# EAGLE design pblcompleted (EAGLE 9.6.2)
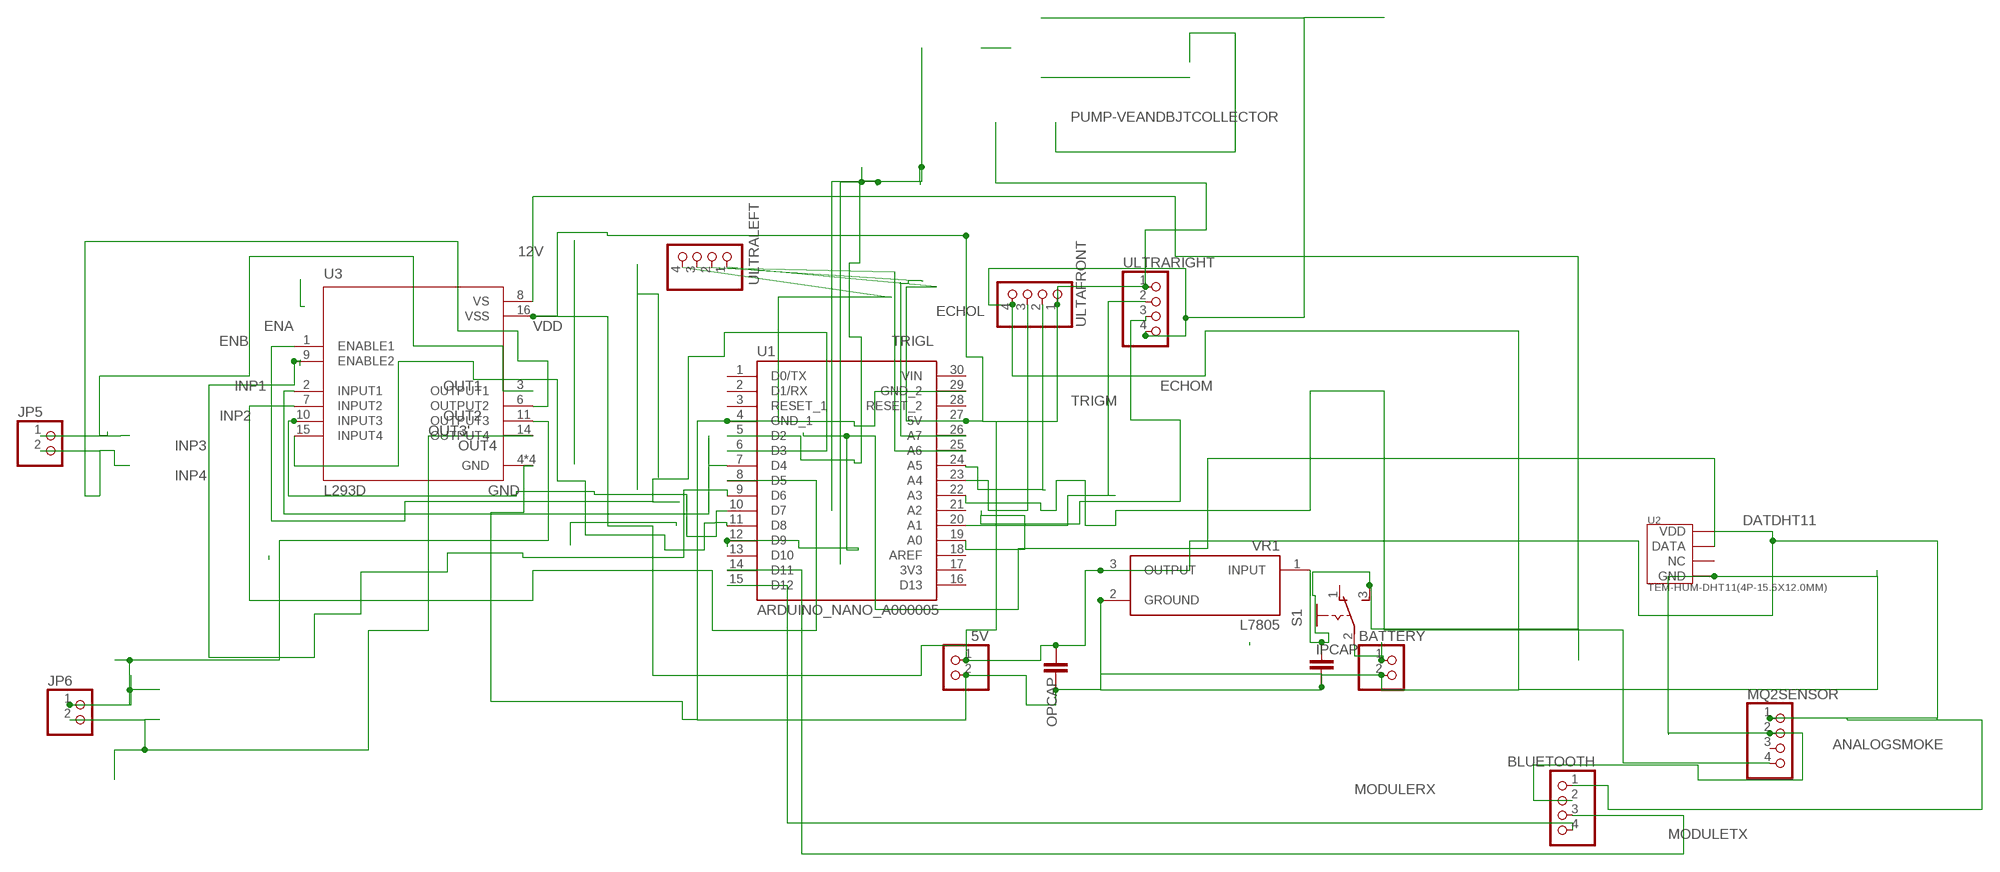
[diagram p0: schematic, sheet 1]

## Parts
5V  PINHD-1X2  [1X02]
BATTERY  PINHD-1X2  [1X02]
BLUETOOTH  PINHD-1X4  [1X04]
IPCAP  C2,5-3  [C2.5-3]
JP5  PINHD-1X2  [1X02]
JP6  PINHD-1X2  [1X02]
MQ2SENSOR  PINHD-1X4  [1X04]
OPCAP  C2,5-3  [C2.5-3]
S1  255SB  [255SB]
U1  ARDUINO_NANO_A000005  [MODULE_ARDUINO_NANO_A000005]
U2  TEM-HUM-DHT11(4P-15.5X12.0MM)  [SNR4-2.54-15.5X12.0X5.5MM]
U3  L293D  [DIP880W50P254L2000H510Q16]
ULTAFRONT  PINHD-1X4  [1X04]
ULTRALEFT  PINHD-1X4  [1X04]
ULTRARIGHT  PINHD-1X4  [1X04]
VR1  L7805  [TO255P1020X450X2000-3]

## Nets
12V: IPCAP.1 S1.3(S) U3.8(VS) VR1.1(INPUT)
ANALOGSMOKE: MQ2SENSOR.4 U1.22(A3)
DATDHT11: U1.12(D9) U2.2(DATA)
ECHOL: U1.25(A6) ULTRALEFT.3
ECHOM: U1.23(A4) ULTAFRONT.3
ECHOR: U1.19(A0) ULTRARIGHT.3
ENA: U1.6(D3) U3.1(ENABLE1)
ENB: U1.9(D6) U3.9(ENABLE2)
GND: 5V.2 BATTERY.2 BLUETOOTH.2 IPCAP.2 MQ2SENSOR.2 OPCAP.1 U1.4(GND_1) U1.29(GND_2) U2.4(GND) U3.4(GND) U3.5(GND) U3.12(GND) U3.13(GND) ULTAFRONT.4 ULTRALEFT.4 ULTRARIGHT.4 VR1.2(GROUND)
INP1: U1.7(D4) U3.2(INPUT1)
INP2: U1.8(D5) U3.7(INPUT2)
INP3: U1.10(D7) U3.10(INPUT3)
INP4: U1.11(D8) U3.15(INPUT4)
MODULERX: BLUETOOTH.4 U1.15(D12)
MODULETX: BLUETOOTH.3 U1.14(D11)
N$6: BATTERY.1 S1.2(P)
N$14: U1.5(D2)
OUT1: JP5.1 U3.3(OUTPUT1)
OUT2: JP5.2 U3.6(OUTPUT2)
OUT3': JP6.1 U3.11(OUTPUT3)
OUT4: JP6.2 U3.14(OUTPUT4)
TRIGL: U1.26(A7) ULTRALEFT.2
TRIGM: U1.24(A5) ULTAFRONT.2
TRIGR: U1.20(A1) ULTRARIGHT.2
VDD: 5V.1 BLUETOOTH.1 MQ2SENSOR.1 OPCAP.2 U1.27(5V) U2.1(VDD) U3.16(VSS) ULTAFRONT.1 ULTRALEFT.1 ULTRARIGHT.1 VR1.3(OUTPUT)
Unconnected: MQ2SENSOR.3 S1.1(O) U1.1(D0/TX) U1.2(D1/RX) U1.3(RESET_1) U1.13(D10) U1.16(D13) U1.18(AREF) U1.21(A2) U1.28(RESET_2) U2.3(NC)

## Power pins joined to a net without a drawn wire
3V3: U1.17(3V3)
VIN: U1.30(VIN)

## Library data of the parts
5V BATTERY JP5 JP6 = pinhead:PINHD-1X2: PIN HEADER
BLUETOOTH MQ2SENSOR ULTAFRONT ULTRALEFT ULTRARIGHT = pinhead:PINHD-1X4: PIN HEADER
IPCAP OPCAP = capacitor-wima:C: CAPACITOR naming: grid - package width
S1 = switch:255SB: SLIDING SWITCH Distributor Buerklin, 11G810
U1 = ARDUINO_NANO_A000005:ARDUINO_NANO_A000005: Check availability <https://pricing.snapeda.com/parts/ARDUINO%20NANO%20A000005/Arduino/view-part?ref=eda>; AVAILABILITY: Not in stock; CHECK_PRICES: https://www.snapeda.com/parts/ARDUINO%20NANO%20A000005/Arduino/view-part/?ref=eda; DESCRIPTION: ATSAMD21G18A Arduino Nano 33 IoT series ARM® Cortex®-M0+ MCU 32-Bit Embedded Evaluation Board; MF: Arduino; MP: ARDUINO NANO A000005; PACKAGE: Non-Standard Arduino; PRICE: None; SNAPEDA_LINK: https://www.snapeda.com/parts/ARDUINO%20NANO%20A000005/Arduino/view-part/?ref=snap
U2 = TEM-HUM-DHT11_4P-15.5X12.0MM_:TEM-HUM-DHT11(4P-15.5X12.0MM): Check availability <https://pricing.snapeda.com/parts/DHT11/aosong/view-part?ref=eda>; AVAILABILITY: In Stock; CHECK_PRICES: https://www.snapeda.com/parts/DHT11/Aosong+Electronics/view-part/?ref=eda; DESCRIPTION: Temperature Humidity Sensor 16bi; MF: aosong; MP: DHT11; PACKAGE: None; PRICE: None; SNAPEDA_LINK: https://www.snapeda.com/parts/DHT11/Aosong+Electronics/view-part/?ref=snap
U3 = L293D:L293D: Check availability <https://pricing.snapeda.com/parts/L293D/STMicroelectronics/view-part?ref=eda>; AVAILABILITY: In Stock; CHECK_PRICES: https://www.snapeda.com/parts/L293D/STMicroelectronics/view-part/?ref=eda; DESCRIPTION: Bipolar Motor Driver - Parallel 16-PowerDIP; MF: STMicroelectronics; MP: L293D; PACKAGE: DIP-16 STMicroelectronics; PRICE: None; SNAPEDA_LINK: https://www.snapeda.com/parts/L293D/STMicroelectronics/view-part/?ref=snap
VR1 = L7805:L7805: Check availability <https://pricing.snapeda.com/parts/L7805/STMicroelectronics/view-part?ref=eda>; AVAILABILITY: In Stock; CHECK_PRICES: https://www.snapeda.com/parts/L7805/STMicroelectronics/view-part/?ref=eda; DESCRIPTION: Standard Regulator Pos 5V 1.5A 3-Pin(3+Tab) TO-220FP Tube; MF: STMicroelectronics; MP: L7805; PACKAGE: None; PRICE: None; SNAPEDA_LINK: https://www.snapeda.com/parts/L7805/STMicroelectronics/view-part/?ref=snap

## Board
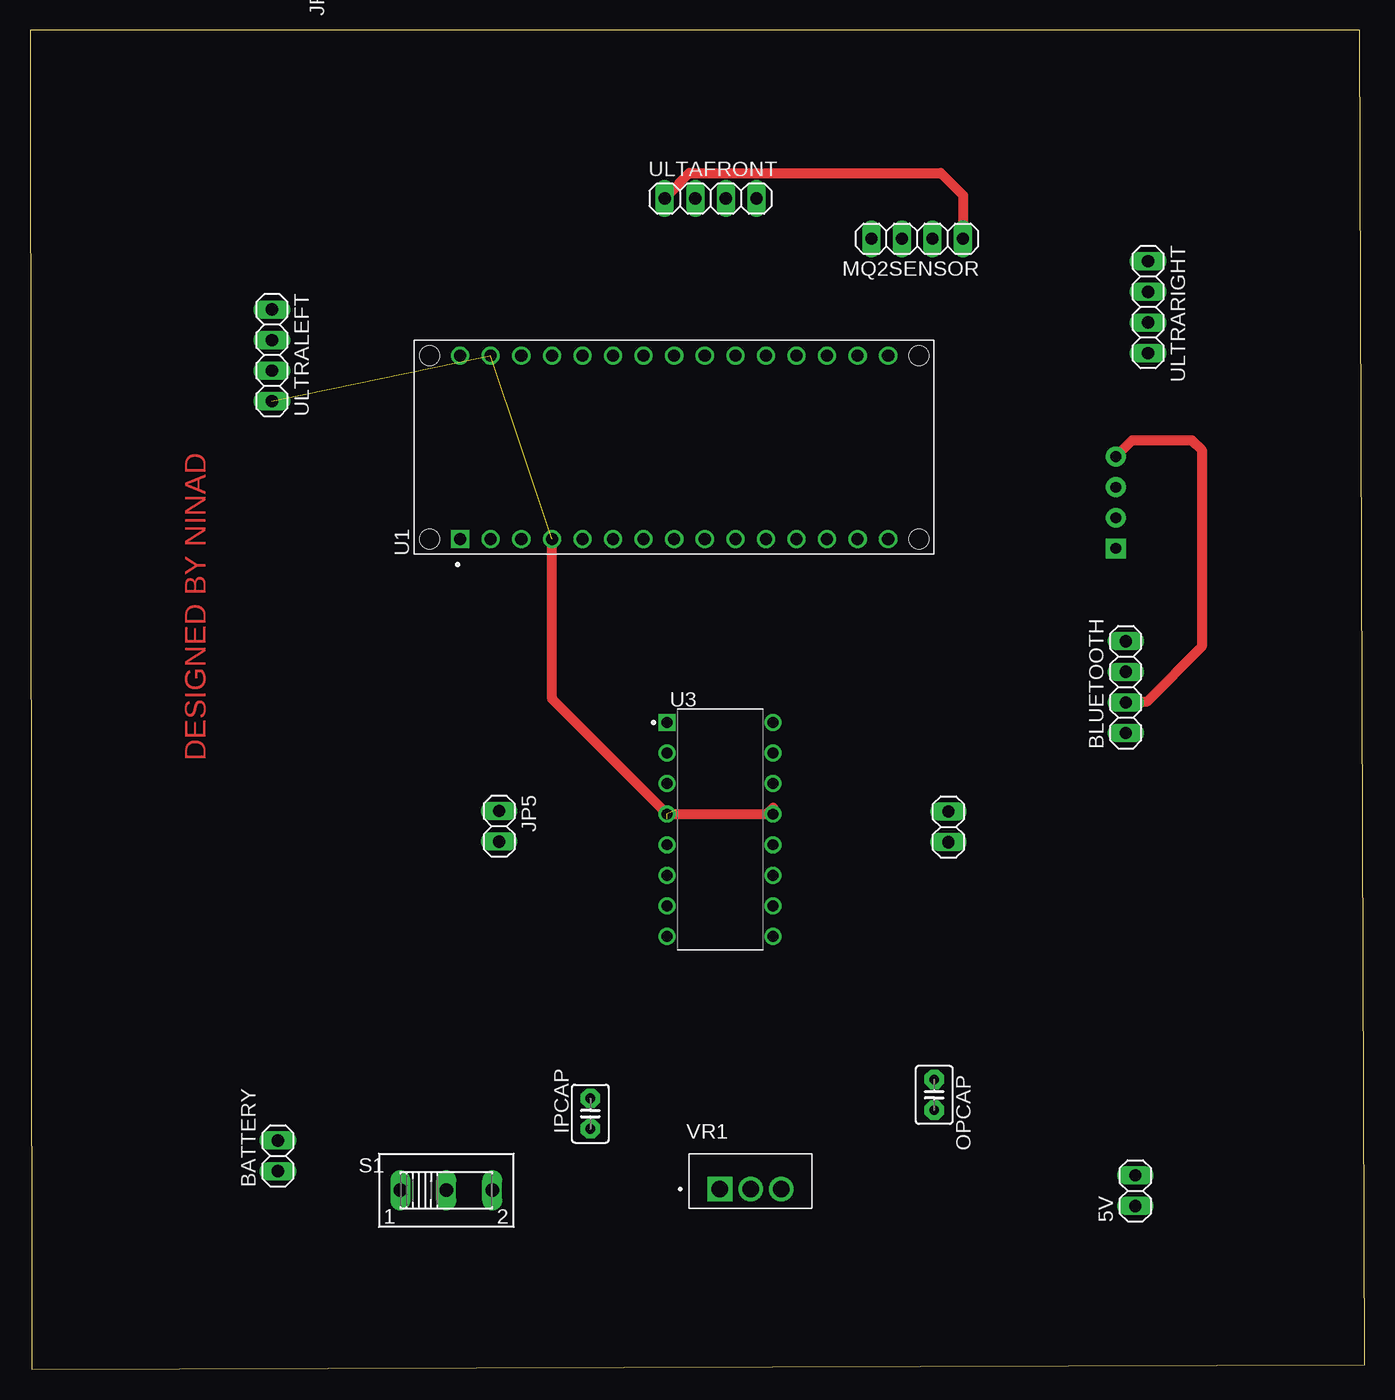
[diagram p1: board, top side]
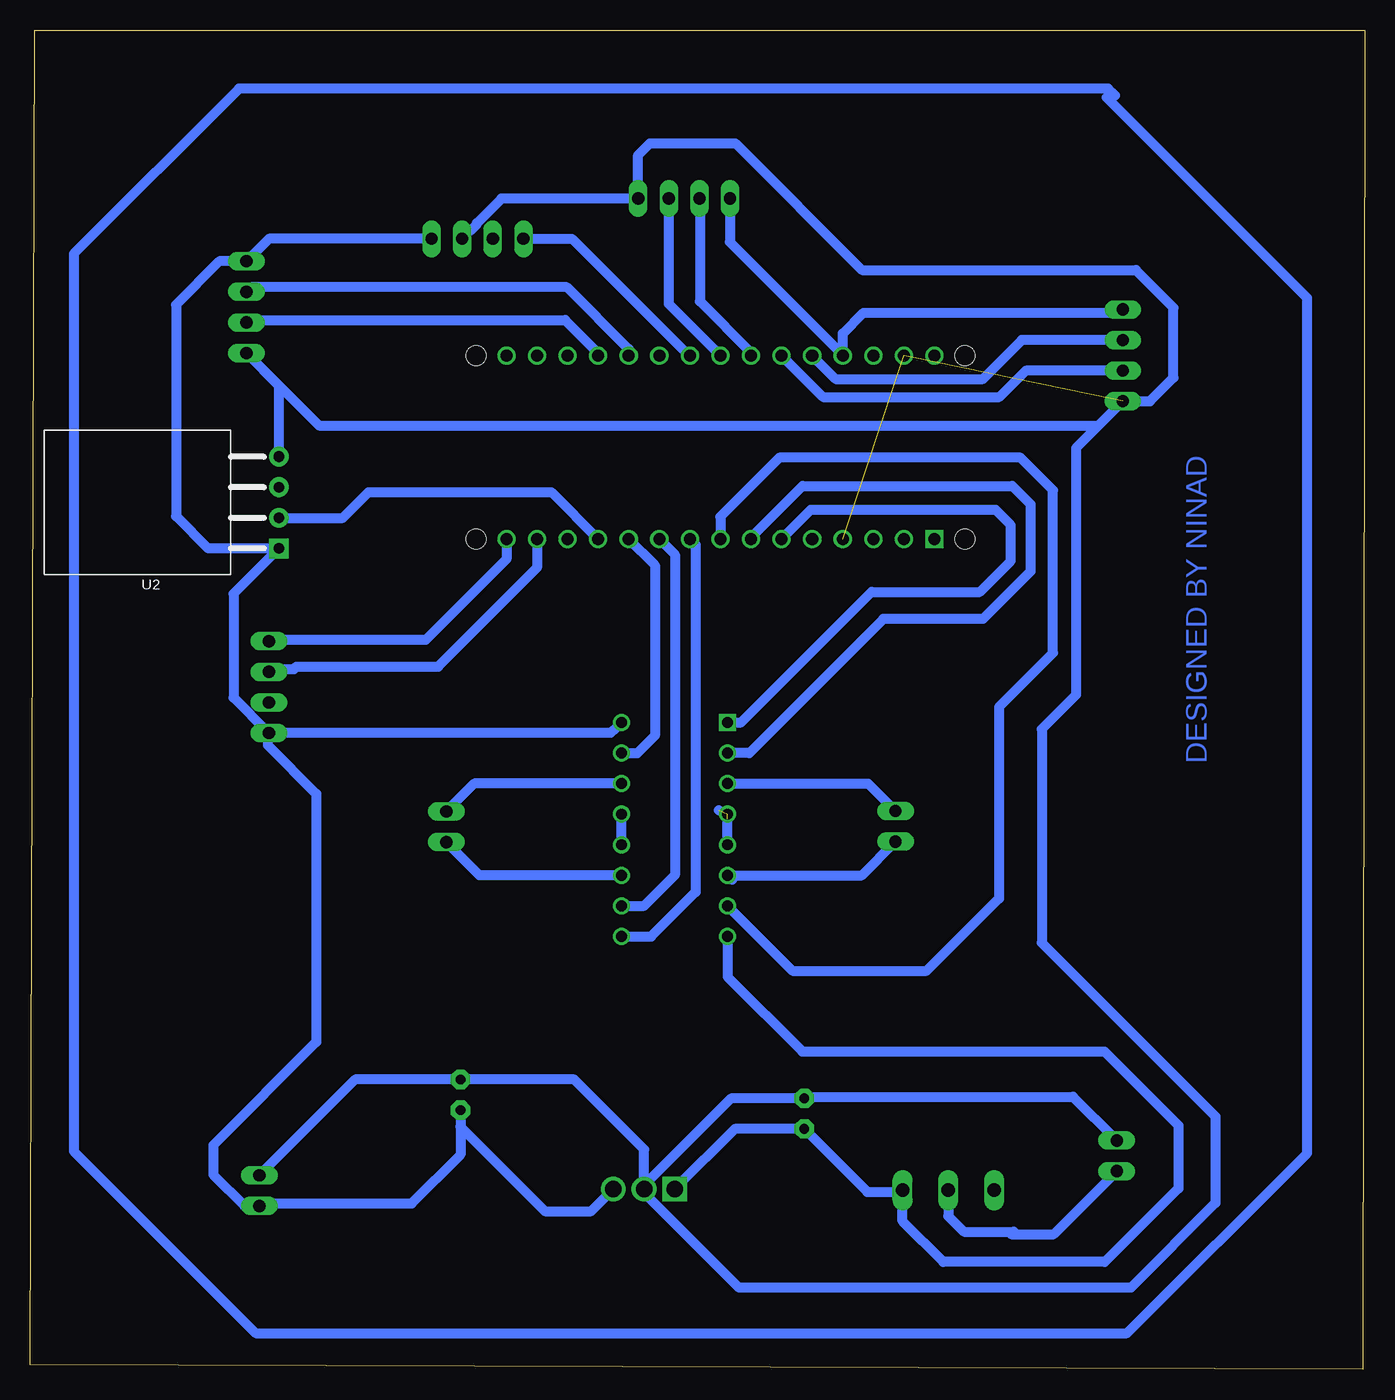
[diagram p2: board, bottom side, seen from below]

Size 110.87 x 111.27 mm. Coordinates in mm from the lower left corner, seen from the top.
Outline: 0.13,0 110.87,0.38 110.46,111.24 0,111.27 0.13,0
Copper layers (1*16): Top 0.035mm / dielectric 1.5mm / Bottom 0.035mm
Design rules "default": minimum track width 6mil, minimum drill 0.35mm, track to track 6mil, track to pad 6mil, pad to pad 6mil, via to via 6mil, smd to smd 6mil, copper to edge 40mil, drill to drill 6mil, minimum pad ring 10mil, minimum via ring 8mil, stop-mask expansion 4mil, vias tented up to drill 0mil, thermal gap 10mil

### Footprints (pad centres in the part's own frame; a part is rotated, then mirrored left to right if it is on the bottom)
1X02 = drill 1.016 long: 1 -1.27,0; 2 1.27,0
1X04 = drill 1.016 long: 1 -3.81,0; 2 -1.27,0; 3 1.27,0; 4 3.81,0
C2.5-3 = drill 0.813 pad 1.6 octagon: 1 -1.27,0; 2 1.27,0
255SB = drill 1.118 long: 1 -3.81,0; 2 0,0; 3 3.81,0
MODULE_ARDUINO_NANO_A000005 = drill 1 square: 1 -7.62,17.78 | drill 1: 2 -7.62,15.24; 3 -7.62,12.7; 4 -7.62,10.16; 5 -7.62,7.62; 6 -7.62,5.08; 7 -7.62,2.54; 8 -7.62,0; 9 -7.62,-2.54; 10 -7.62,-5.08; 11 -7.62,-7.62; 12 -7.62,-10.16; 13 -7.62,-12.7; 14 -7.62,-15.24; 15 -7.62,-17.78; 16 7.62,-17.78; 17 7.62,-15.24; 18 7.62,-12.7; 19 7.62,-10.16; 20 7.62,-7.62; 21 7.62,-5.08; 22 7.62,-2.54; 23 7.62,0; 24 7.62,2.54; 25 7.62,5.08; 26 7.62,7.62; 27 7.62,10.16; 28 7.62,12.7; 29 7.62,15.24; 30 7.62,17.78 | hole 1.651: -7.62,-20.32; 7.62,-20.32; -7.62,20.32; 7.62,20.32
SNR4-2.54-15.5X12.0X5.5MM = drill 0.889 pad 1.651 square: 1 -11.75,3.81 | drill 0.889 pad 1.651: 2 -11.75,1.27; 3 -11.75,-1.27; 4 -11.75,-3.81
DIP880W50P254L2000H510Q16 = drill 0.9 pad 1.25 square: 1 -4.4,8.89 | drill 0.9 pad 1.25: 2 -4.4,6.35; 3 -4.4,3.81; 4 -4.4,1.27; 5 -4.4,-1.27; 6 -4.4,-3.81; 7 -4.4,-6.35; 8 -4.4,-8.89; 9 4.4,-8.89; 10 4.4,-6.35; 11 4.4,-3.81; 12 4.4,-1.27; 13 4.4,1.27; 14 4.4,3.81; 15 4.4,6.35; 16 4.4,8.89
TO255P1020X450X2000-3 = drill 1.37 square: 1 -2.55,-0.662 | drill 1.37: 2 0,-0.662; 3 2.55,-0.662

### Placement (x,y rotation side)
5V  91.82,14.84 90 top
BATTERY  20.59,17.74 90 top
BLUETOOTH  91.03,56.68 90 top
IPCAP  46.55,21.25 90 top
JP5  38.97,45.12 270 top
JP6  76.29,45.07 90 top
MQ2SENSOR  73.7,93.93 180 top
OPCAP  75.11,22.81 270 top
S1  34.58,14.88 0 top
U1  53.51,76.61 90 top
U2  101.95,72.02 180 bottom
U3  57.32,44.86 0 top
ULTAFRONT  56.53,97.28 0 top
ULTRALEFT  20.08,84.25 270 top
ULTRARIGHT  92.89,88.25 270 top
VR1  59.86,15.65 0 top

### Tracks (layer width: path | path; a pad name or v marks a point on that pad's centre or on a via)
12V
  Bottom 0.813: U3.8 52.92,32.62 46.71,26.4 21.6,26.4 15.46,20.26 15.46,15.04 21.58,8.92 34.99,8.92 38.39,12.32 S1.3 38.53,14.75 41.31,14.75 IPCAP.1 52.32,19.98 VR1.1
ANALOGSMOKE
  Bottom 0.813: MQ2SENSOR.4 65.84,93.93 56.14,84.23 U1.22
DATDHT11
  Bottom 0.813: U2.2 84.88,70.75 82.74,72.88 67.56,72.88 U1.12
ECHOL
  Bottom 0.813: U1.25 44.99,80.79 30.34,80.79 28.16,82.98 ULTRALEFT.3
ECHOM
  Bottom 0.813: ULTAFRONT.3 57.82,97.26 57.82,88.54 U1.23
ECHOR
  Bottom 0.813: 92.55,87.32 ULTRARIGHT.3 92.69,87.17 66.42,87.17 63.67,84.43 U1.19
ENA
  Bottom 0.813: U3.1 51.8,53.75 40.96,64.59 31.97,64.59 29.39,67.17 29.39,70.14 30.64,71.39 46.02,71.39 U1.6
ENB
  Bottom 0.813: U1.9 55.58,68.52 55.58,39.66 59.27,35.97 U3.9
GND  (4 unrouted)
  Top 0.813: BLUETOOTH.2 91.12,55.5 92.81,55.5 97.34,60.04 97.34,76.4 96.56,77.18 91.55,77.18 U2.4 | U1.4 43.35,55.79 43.37,55.77 43.37,55.68 U3.4 61.22,46.13 61.74,46.65 61.74,46.15 U3.13
  Bottom 0.813: 5V.2 83.86,24.08 OPCAP.1 65.66,24.08 59.86,18.28 VR1.2 | VR1.2 59.86,15.28 52.62,22.52 IPCAP.2 46.41,22.65 24.23,22.65 BATTERY.2 | U3.12 U3.13 | U3.5 52.92,45.72 | U1.4 | ULTRALEFT.4 | ULTRALEFT.4 17.82,80.44 15.87,82.39 15.87,88.2 19,91.33 41.74,91.33 52.26,101.85 59.38,101.85 60.34,100.89 ULTAFRONT.4 71.71,97.28 73.75,95.24 73.75,95.15 MQ2SENSOR.2 | ULTRALEFT.4 22.11,78.41 86.86,78.41 ULTRARIGHT.4 90.2,81.75 U2.4 | ULTRALEFT.4 23.98,76.53 23.98,56.03 26.81,53.2 26.81,35.45 12.38,21.02 12.38,13.83 19.41,6.8 51.97,6.8 59.86,14.69 VR1.2 | 53.67,46.47
INP1
  Bottom 0.813: U1.7 50.97,69.11 46.69,73.4 29.27,73.4 27.75,71.87 27.75,66.29 31.69,62.35 39.98,62.35 51.12,51.21 U3.2
INP2
  Bottom 0.813: U1.8 53.51,70.85 48.62,75.74 28.58,75.74 25.88,73.04 25.88,59.52 30.38,55.02 30.38,39.12 36.39,33.11 47.52,33.11 U3.7
INP3
  Bottom 0.813: U3.10 59.85,38.51 57.29,41.07 57.29,67.69 U1.10
INP4
  Bottom 0.813: U3.15 60.42,51.21 58.97,52.66 58.97,66.82 U1.11
MODULERX  (via drill 0.35)
  Bottom 0.813: BLUETOOTH.4 90.78,60.49 v90.78,60.47 90.63,60.63 77.98,60.63 71.29,67.32 U1.15
MODULETX  (via drill 0.35)
  Bottom 0.813: BLUETOOTH.3 90.96,57.95 v90.96,58.18 88.97,58.18 88.76,58.39 76.96,58.39 68.75,66.6 U1.14
N$1
  Bottom 0.813: 20.73,105.84 21.31,106.42 93.5,106.42 107.24,92.67 107.24,18.13 92.11,3 19.74,3 4.77,17.97 4.77,89 21.42,105.65
N$6
  Bottom 0.813: S1.2 34.58,12.74 33.28,11.44 29.15,11.44 29.35,11.24 25.82,11.24 BATTERY.1
OUT1
  Bottom 0.813: U3.3 41.25,48.67 JP5.1
OUT2
  Bottom 0.813: 52.54,40.67 U3.6 41.77,41.05 JP5.2
OUT3'
  Bottom 0.813: U3.11 73.54,41.05 JP6.1
OUT4
  Bottom 0.813: U3.14 73.97,48.67 JP6.2
TRIGL
  Bottom 0.813: ULTRALEFT.2 28.48,85.52 31.7,82.29 43.95,82.29 U1.26
TRIGM
  Bottom 0.813: ULTAFRONT.2 55.23,97.25 55.23,88.75 50.97,84.49 U1.24
TRIGR
  Bottom 0.813: U1.20 61.13,84.77 66.27,89.91 92.5,89.91 ULTRARIGHT.2
VDD  (via drill 0.35)
  Top 0.813: ULTAFRONT.1 53.94,98.5 53.94,98.59 54.75,99.39 75.66,99.39 77.51,97.54 MQ2SENSOR.1
  Bottom 0.813: VR1.3 64.25,13.14 68.09,13.14 75.11,20.17 OPCAP.2 75.11,17.83 79.17,13.78 91.61,13.78 5V.1 93.06,13.57 95.65,16.17 95.65,18.63 87.09,27.2 87.09,47.83 91.13,51.86 v91.13,52.83 91.09,52.87 BLUETOOTH.1 | ULTRALEFT.1 20.35,87.79 41.62,87.79 43.35,86.05 U1.27 43.35,84.28 52.72,93.65 ULTAFRONT.1 | MQ2SENSOR.1 91.02,93.93 ULTRARIGHT.1 95.14,92.06 98.75,88.45 98.75,70.89 96.06,68.21 U2.1 93.96,64.44 93.96,55.81 BLUETOOTH.1 | BLUETOOTH.1 62.63,52.87 62.35,53.16 62.31,53.16 U3.16

### Text on the board
Top: DESIGNED BY NINAD
Bottom: DESIGNED BY NINAD